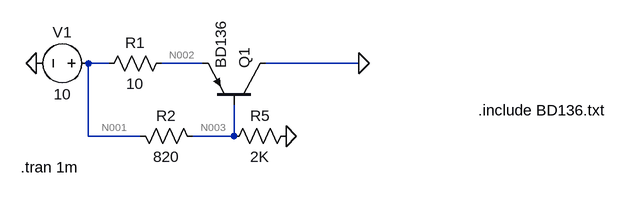
[diagram p0: schematic Lab2_betameasurement.asc]
Lab2_betameasurement.asc, the LTspice schematic file:
Version 4
SHEET 1 880 680
WIRE -64 144 -96 144
WIRE 80 144 16 144
WIRE 320 144 176 144
WIRE -96 256 -96 144
WIRE -16 256 -96 256
WIRE 128 256 128 208
WIRE 128 256 64 256
FLAG -176 144 0
FLAG 320 144 0
FLAG 208 256 0
SYMBOL res -32 240 M90
WINDOW 0 0 56 VBottom 2
WINDOW 3 32 56 VTop 2
SYMATTR InstName R2
SYMATTR Value 820
SYMBOL pnp 176 208 M270
SYMATTR InstName Q1
SYMATTR Value BD136
SYMBOL voltage -80 144 R90
WINDOW 0 -32 56 VBottom 2
WINDOW 3 32 56 VTop 2
WINDOW 123 0 0 Left 0
WINDOW 39 0 0 Left 0
SYMATTR InstName V1
SYMATTR Value 10
SYMBOL res 32 128 R90
WINDOW 0 0 56 VBottom 2
WINDOW 3 32 56 VTop 2
SYMATTR InstName R1
SYMATTR Value 10
SYMBOL res 224 240 R90
WINDOW 0 0 56 VBottom 2
WINDOW 3 32 56 VTop 2
SYMATTR InstName R5
SYMATTR Value 2K
TEXT -200 304 Left 2 !.tran 1m
TEXT 504 216 Left 2 !.include BD136.txt

The netlist it stands for:
* Lab2_betameasurement.asc
R2 N001 N003 820
Q1 0 N003 N002 0 BD136
V1 N001 0 10
R1 N002 N001 10
R5 0 N003 2K
.model NPN NPN
.model PNP PNP
.lib standard.bjt
.tran 1m
.include BD136.txt
.backanno
.end

* Results of the author's LTspice run, read from the files saved beside the schematic
* Operating Point, zero values left out:
*   V(n001) = 10 V
*   V(n003) = 7.596 V
*   V(n002) = 8.368 V
*   Ic(Q1) = -162.3 mA
*   Ib(Q1) = -866.7 µA
*   Ie(Q1) = 163.2 mA
*   I(R2) = 2.931 mA
*   I(R1) = -163.2 mA
*   I(R5) = -3.798 mA
*   I(V1) = -166.1 mA